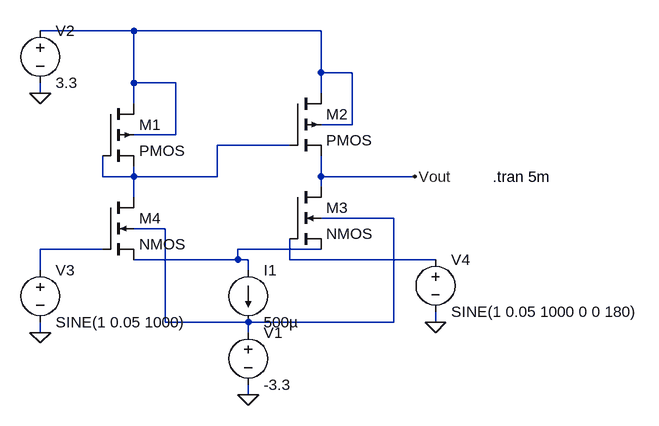
[diagram p0: schematic Draft3.asc]
Draft3.asc, the LTspice schematic file:
Version 4.1
SHEET 1 1208 680
WIRE 80 -32 -64 -32
WIRE 368 -32 80 -32
WIRE 368 32 368 -32
WIRE 416 32 368 32
WIRE 80 48 80 -32
WIRE 144 48 80 48
WIRE -64 64 -64 48
WIRE 368 64 368 32
WIRE 80 80 80 48
WIRE 416 112 416 32
WIRE 416 112 368 112
WIRE 144 128 144 48
WIRE 144 128 80 128
WIRE 320 144 208 144
WIRE 32 192 32 160
WIRE 80 192 80 176
WIRE 80 192 32 192
WIRE 208 192 208 144
WIRE 208 192 80 192
WIRE 368 192 368 160
WIRE 512 192 368 192
WIRE 368 208 368 192
WIRE 80 224 80 192
WIRE 480 256 368 256
WIRE 128 272 80 272
WIRE 32 304 -64 304
WIRE 368 304 240 304
WIRE 240 320 240 304
WIRE 240 320 80 320
WIRE 256 320 240 320
WIRE 320 320 320 288
WIRE 544 320 320 320
WIRE -64 336 -64 304
WIRE 256 336 256 320
WIRE 128 416 128 272
WIRE 256 416 128 416
WIRE 480 416 480 256
WIRE 480 416 256 416
WIRE 544 416 544 400
WIRE -64 432 -64 416
WIRE 256 432 256 416
WIRE 256 528 256 512
FLAG -64 64 0
FLAG -64 432 0
FLAG 256 528 0
FLAG 544 416 0
FLAG 512 192 Vout
DATAFLAG 112 192 ""
DATAFLAG 160 320 ""
DATAFLAG 368 176 ""
DATAFLAG 80 -32 ""
DATAFLAG 480 192 ""
DATAFLAG -32 304 ""
DATAFLAG 112 192 ""
DATAFLAG 144 80 ""
SYMBOL pmos4 32 80 R0
SYMATTR InstName M1
SYMATTR Value2 l=1u w=10u
SYMBOL pmos4 320 64 R0
SYMATTR InstName M2
SYMATTR Value2 l=1u w=10u
SYMBOL nmos4 320 208 R0
SYMATTR InstName M3
SYMATTR Value2 l=1u w=10u
SYMBOL nmos4 32 224 R0
SYMATTR InstName M4
SYMATTR Value2 l=1u w=10u
SYMBOL voltage 256 416 R0
WINDOW 123 0 0 Left 0
WINDOW 39 0 0 Left 0
SYMATTR InstName V1
SYMATTR Value -3.3
SYMBOL voltage -64 -48 R0
WINDOW 123 0 0 Left 0
WINDOW 39 0 0 Left 0
SYMATTR InstName V2
SYMATTR Value 3.3
SYMBOL voltage -64 320 R0
WINDOW 123 0 0 Left 0
WINDOW 39 0 0 Left 0
SYMATTR InstName V3
SYMATTR Value SINE(1 0.05 1000)
SYMBOL voltage 544 304 R0
WINDOW 123 0 0 Left 0
WINDOW 39 0 0 Left 0
SYMATTR InstName V4
SYMATTR Value SINE(1 0.05 1000 0 0 180)
SYMBOL current 256 336 R0
WINDOW 123 0 0 Left 0
WINDOW 39 0 0 Left 0
SYMATTR InstName I1
SYMATTR Value 500µ
TEXT 632 192 Left 2 !.tran 5m

The netlist it stands for:
* Draft3.asc
M1 N001 N002 N002 N001 PMOS l=1u w=10u
M2 N001 N002 Vout N001 PMOS l=1u w=10u
M3 Vout N006 N005 N003 NMOS l=1u w=10u
M4 N002 N004 N005 N003 NMOS l=1u w=10u
V1 N003 0 -3.3
V2 N001 0 3.3
V3 N004 0 SINE(1 0.05 1000)
V4 N006 0 SINE(1 0.05 1000 0 0 180)
I1 N005 N003 500µ
.model NMOS NMOS
.model PMOS PMOS
.lib standard.mos
.tran 5m
.backanno
.end